# Altium schematic sheet 模拟光伏追踪系统原理图.SchDoc
size 444 x 294 mm; PageSetup: Record=PageOptions嶤enterHorizontal=True嶤enterVertical=True嶱rintScale=0.64嶺Correction=1.00嶻Correction=1.00嶱rintKind=0嶣orderSize=5000000嶭eftOffset=0嶣ottomOffset=0嶰rientation=2嶱aperLength=1000嶱aperWidth=1000嶴cale=100嶱aperSource=7嶱rintQuality=-4嶮ediaType=1嶥itherType=10嶱aperKind=A4 210 x 297 毫米嶱rintScaleMode=1
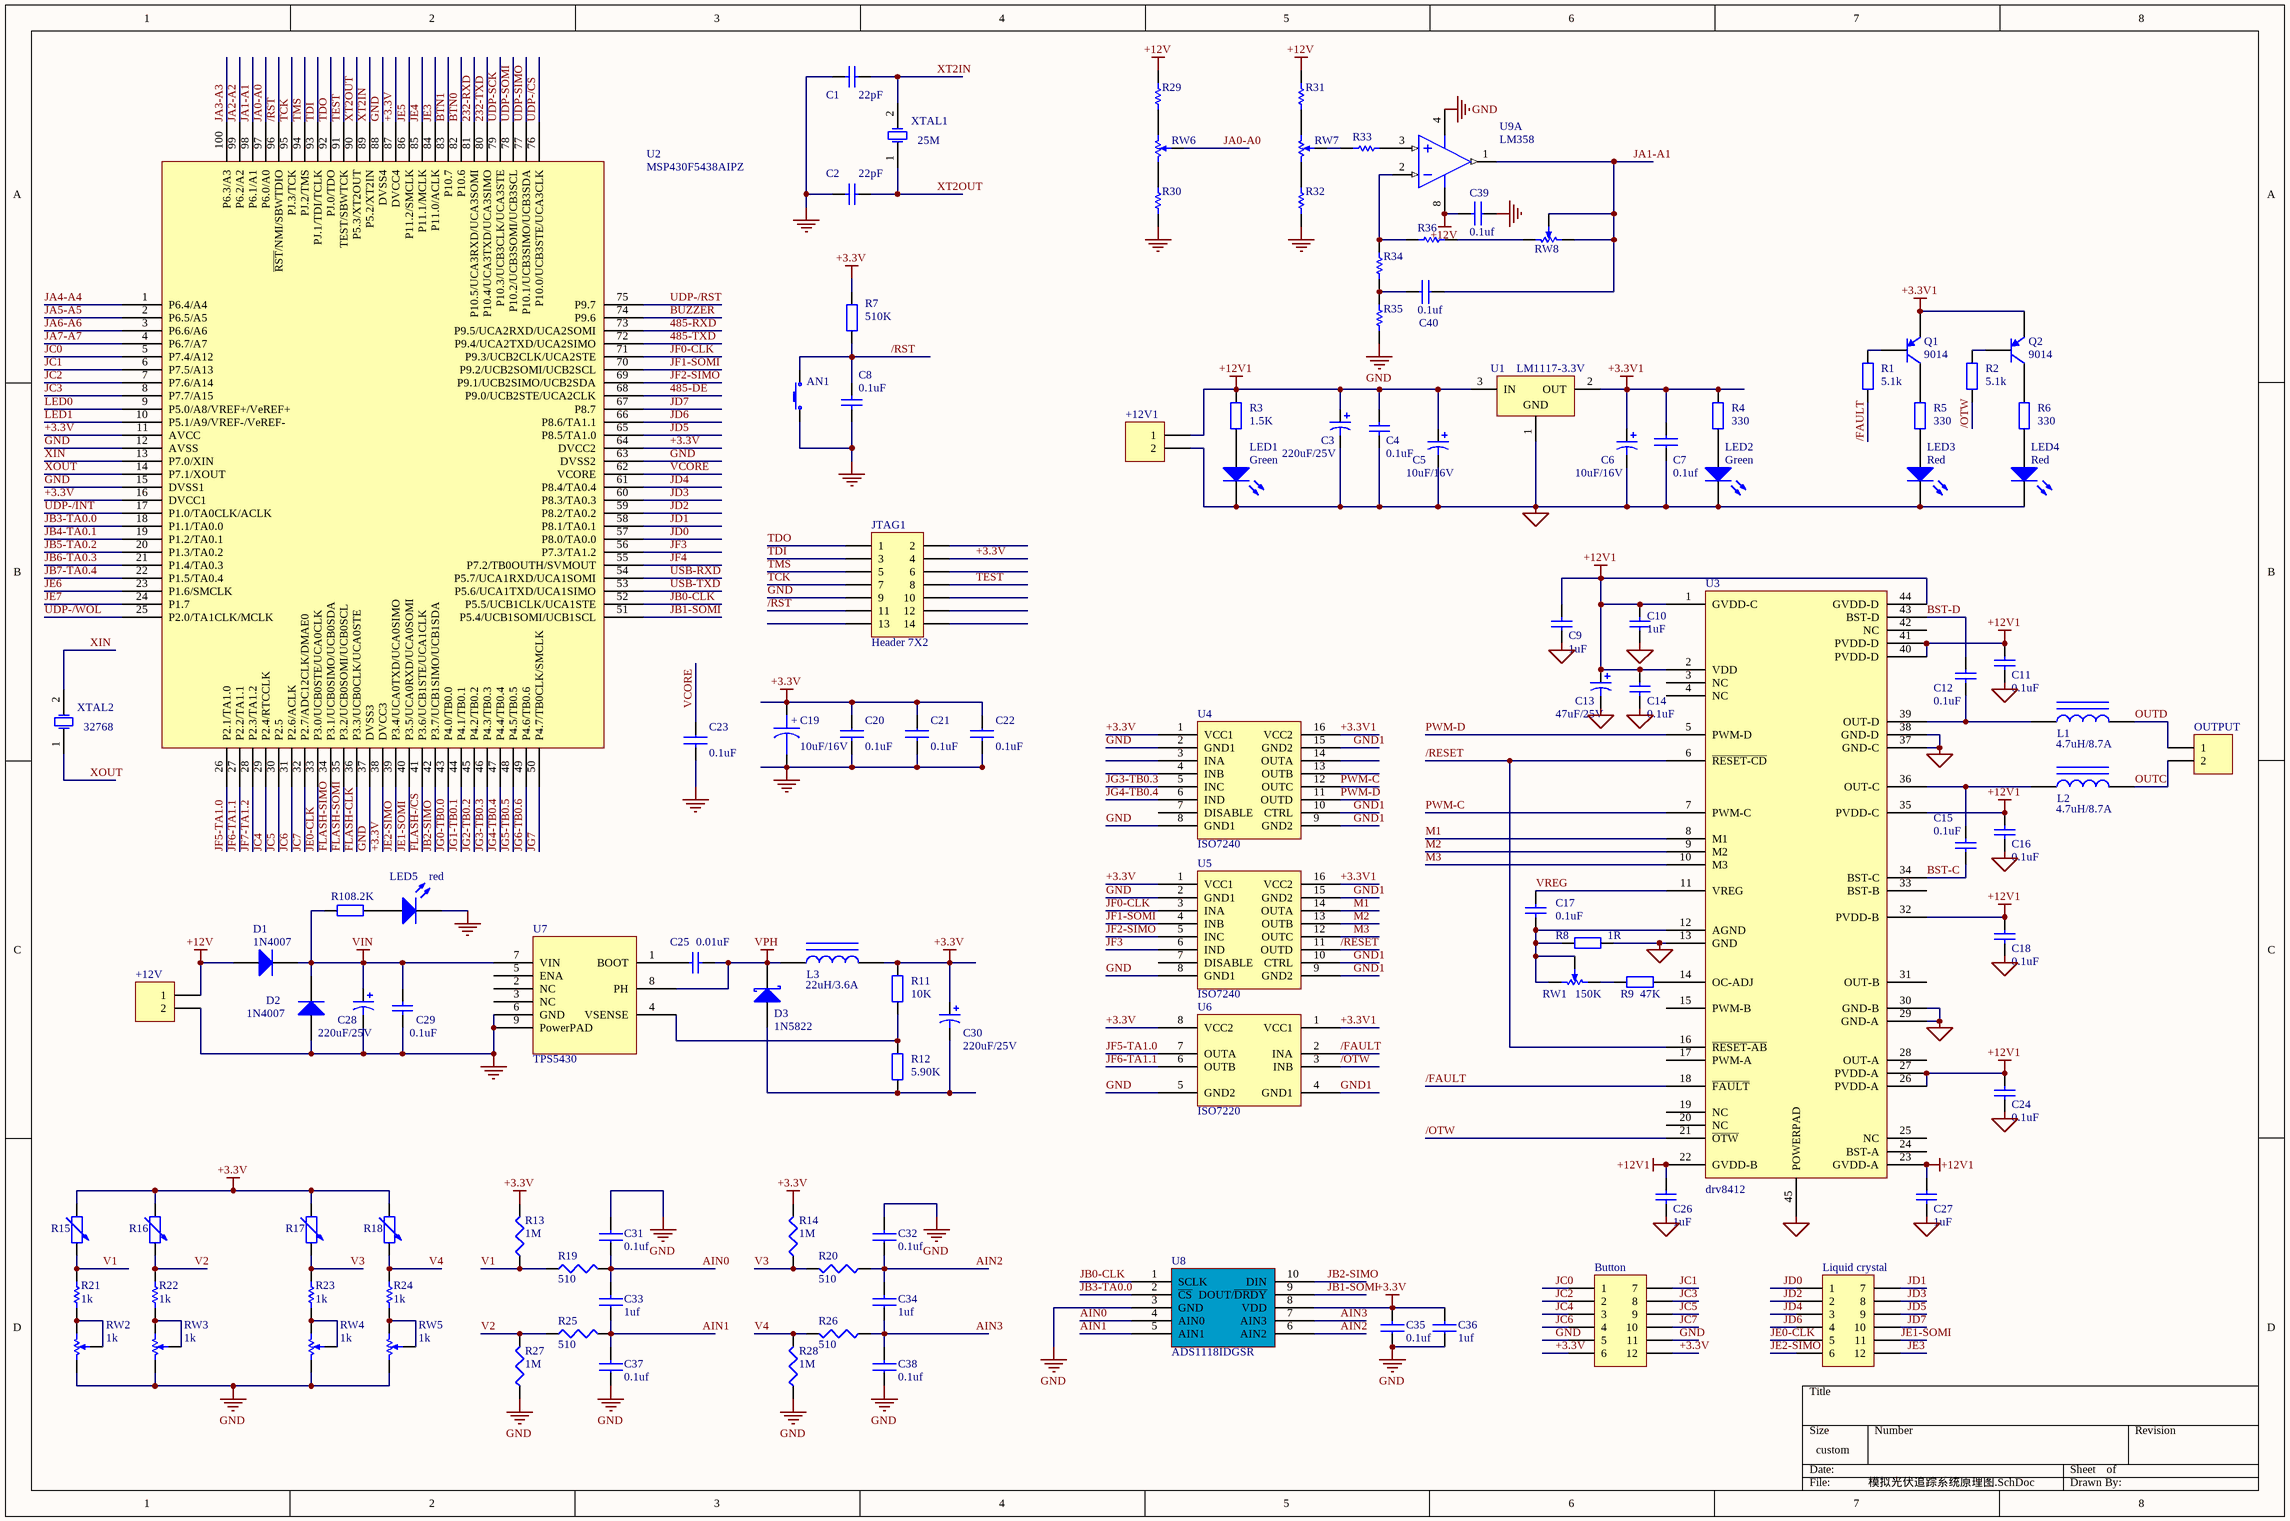
[diagram p0: 模拟光伏追踪系统原理图.SchDoc]

## Parts
+12V  Comment  [接线端子]  (value not drawn)
+12V1  Comment  [接线端子]  (value not drawn)
AN1  key  [AN6X6]  (value not drawn)
Button  Header 6X2A  [PMOD]  (value not drawn)
C1  value 22pF  [0805C]  (hidden comment: Cap)
C2  value 22pF  [0805C]  (hidden comment: Cap)
C3  value 220uF/25V  [CD-220uF-25V]  (hidden comment: Cap Pol1)
C4  value 0.1uF  [0805C]  (hidden comment: Cap)
C5  10uF/16V  [A3216]
C6  10uF/16V  [A3216]
C7  0.1uf  [0805C]
C8  value 0.1uF  [0805C]  (hidden comment: Cap)
C9  value 1uF  [0805C]  (hidden comment: Cap)
C10  value 1uF  [0805C]  (hidden comment: Cap)
C11  value 0.1uF  [0805C]  (hidden comment: Cap)
C12  value 0.1uF  [0805C]  (hidden comment: Cap)
C13  value 47uF/25V  [CD-220uF-25V]  (hidden comment: Cap Pol1)
C14  value 0.1uF  [0805C]  (hidden comment: Cap)
C15  value 0.1uF  [0805C]  (hidden comment: Cap)
C16  value 0.1uF  [0805C]  (hidden comment: Cap)
C17  value 0.1uF  [0805C]  (hidden comment: Cap)
C18  value 0.1uF  [0805C]  (hidden comment: Cap)
C19  10uF/16V  [A3216]
C20  0.1uF  [0805C]
C21  0.1uF  [0805C]
C22  0.1uF  [0805C]
C23  0.1uF  [0805C]
C24  value 0.1uF  [0805C]  (hidden comment: Cap)
C25  value 0.01uF  [0805C]  (hidden comment: Cap)
C26  value 1uF  [0805C]  (hidden comment: Cap)
C27  value 1uF  [0805C]  (hidden comment: Cap)
C28  value 220uF/25V  [CD-220uF-25V]  (hidden comment: Cap Pol1)
C29  value 0.1uF  [0805C]  (hidden comment: Cap)
C30  value 220uF/25V  [CD-220uF-25V]  (hidden comment: Cap Pol1)
C31  0.1uf  [0805C]
C32  0.1uf  [0805C]
C33  1uf  [0805C]
C34  1uf  [0805C]
C35  0.1uf  [0805C]
C36  1uf  [0805C]
C37  0.1uf  [0805C]
C38  0.1uf  [0805C]
C39  0.1uf  [0805C]
C40  0.1uf  [0805C]
D1  1N4007  [D1206]
D2  1N4007  [D1206]
D3  D Schottky  [D1206]  (value not drawn)
JTAG1  Header 7X2  [HDR2X7]
L1  value 4.7uH/8.7A  [CDRH127]  (hidden comment: Inductor Iron)
L2  value 4.7uH/8.7A  [CDRH127]  (hidden comment: Inductor Iron)
L3  value 22uH/3.6A  [CDRH127]  (hidden comment: Inductor Iron)
LED1  (no value)  [0805LED]
LED2  (no value)  [0805LED]
LED3  (no value)  [0805LED]
LED4  (no value)  [0805LED]
LED5  (no value)  [0805LED]
Liquid_crystal  Header 6X2A  [PMOD]  (value not drawn)
OUTPUT  Comment  [接线端子]  (value not drawn)
Q1  9014  [SOT-23B]
Q2  9014  [SOT-23B]
R1  value 5.1k  [0805R]  (hidden comment: Res2)
R2  value 5.1k  [0805R]  (hidden comment: Res2)
R3  value 1.5K  [0805R]  (hidden comment: Res2)
R4  value 330  [0805R]  (hidden comment: Res2)
R5  value 330  [0805R]  (hidden comment: Res2)
R6  value 330  [0805R]  (hidden comment: Res2)
R7  value 510K  [0805R]  (hidden comment: Res2)
R8  value 1R  [0805R]  (hidden comment: Res2)
R9  value 47K  [0805R]  (hidden comment: Res2)
R10  value 8.2K  [0805R]  (hidden comment: Res2)
R11  value 10K  [0805R]  (hidden comment: Res2)
R12  value 5.90K  [0805R]  (hidden comment: Res2)
R13  1M  [0805R]
R14  1M  [0805R]
R15  (no value)  [RL]
R16  (no value)  [RL]
R17  (no value)  [RL]
R18  (no value)  [RL]
R19  510  [0805R]
R20  510  [0805R]
R21  1k  [0805R]
R22  1k  [0805R]
R23  1k  [0805R]
R24  1k  [0805R]
R25  510  [0805R]
R26  510  [0805R]
R27  1M  [0805R]
R28  1M  [0805R]
R29  (no value)  [0805R]
R30  (no value)  [0805R]
R31  (no value)  [0805R]
R32  (no value)  [0805R]
R33  (no value)  [0805R]
R34  (no value)  [0805R]
R35  (no value)  [0805R]
R36  (no value)  [0805R]
RW1  150K  [3362RW]
RW2  1k  [3296W]
RW3  1k  [3296W]
RW4  1k  [3296W]
RW5  1k  [3296W]
RW6  (no value)  [3296W]
RW7  (no value)  [3296W]
RW8  (no value)  [3296W]
U1  LM1117-3.3V  [SOT-223]
U2  MSP430F5438AIPZ  [TSQFP50P1600X1600X160-100N]
U3  drv8412  [SOP127P600-8N]
U4  ISO7240  [SOIC-16]
U5  ISO7240  [SOIC-16]
U6  ISO7220  [SOIC-8]
U7  TPS5430  [SOIC127P600X170_HS-8N]
U8  ADS1118IDGSR  [VSSOP-10]
U9  LM358  [SOIC-8]  (part A of 2)
XTAL1  XTAL  [XTAL-A]  (value not drawn)
XTAL2  XTAL  [XTAL-B]  (value not drawn)

## Nets
+3.3V: Button.6 Button.12 C19.1 C20.1 C21.1 C22.1 C30.1 C35.2 C36.2 JTAG1.4 L3.2 R7.2 R11.2 R13.2 R14.2 R15.1 R16.1 R17.1 R18.1 U2.11(AVCC) U2.16(DVCC1) U2.38(DVCC3) U2.64(DVCC2) U2.87(DVCC4) U4.1(VCC1) U5.1(VCC1) U6.8(VCC2) U8.8(VDD)
+3.3V1: C6.1 C7.2 Q1.3(E) Q2.3(E) R4.1 U1.2(OUT) U4.16(VCC2) U5.16(VCC2) U6.1(VCC1)
+12V: +12V.1 C39.2 D1.1(A) R29.2 R31.2 U9.8(V+)
+12V1: +12V1.1 C3.1 C4.2 C5.1 C9.2 C10.2 C11.2 C13.1 C14.2 C16.2 C18.2 C24.2 C26.2 C27.2 R3.2 U1.3(IN) U3.1(GVDD-C) U3.2(VDD) U3.22(GVDD-B) U3.23(GVDD-A) U3.26(PVDD-A) U3.27(PVDD-A) U3.32(PVDD-B) U3.35(PVDD-C) U3.40(PVDD-D) U3.41(PVDD-D) U3.44(GVDD-D)
GND: +12V.2 AN1.1 Button.5 Button.11 C1.1 C2.1 C8.1 C19.2 C20.2 C21.2 C22.2 C23.2 C28.2 C29.1 C31.2 C32.2 C35.1 C36.1 C37.1 C38.1 C39.1 D2.1(A) JTAG1.9 LED5.2(K) R27.1 R28.1 R30.1 R32.1 R35.1 RW2.1 RW3.1 RW4.1 RW5.1 U2.12(AVSS) U2.15(DVSS1) U2.37(DVSS3) U2.63(DVSS2) U2.88(DVSS4) U4.2(GND1) U4.8(GND1) U5.2(GND1) U5.8(GND1) U6.5(GND2) U7.6(GND) U7.9(PowerPAD) U8.3(GND) U9.4(V-)
GND1: +12V1.2 C3.2 C4.1 C5.2 C6.2 C7.1 C9.1 C10.1 C11.1 C13.2 C14.1 C16.1 C18.1 C24.1 C26.1 C27.1 LED1.2(K) LED2.2(K) LED3.2(K) LED4.2(K) R8.2 U1.1(GND) U3.13(GND) U3.29(GND-A) U3.30(GND-B) U3.37(GND-C) U3.38(GND-D) U3.45(POWERPAD) U4.9(GND2) U4.10(CTRL) U4.15(GND2) U5.9(GND2) U5.10(CTRL) U5.15(GND2) U6.4(GND1)
VIN: C28.1 C29.2 D1.2(K) D2.2(K) R10.1 U7.7(VIN)
VPH: C25.2 D3.2(K) L3.1 U7.8(PH)
232-RXD: U2.81(P10.5/UCA3RXD/UCA3SOMI)
232-TXD: U2.80(P10.4/UCA3TXD/UCA3SIMO)
485-DE: U2.68(P9.0/UCB2STE/UCA2CLK)
485-RXD: U2.73(P9.5/UCA2RXD/UCA2SOMI)
485-TXD: U2.72(P9.4/UCA2TXD/UCA2SIMO)
/FAULT: R1.2 U3.18(~{FAULT}) U6.2(INA)
/OTW: R2.2 U3.21(~{OTW}) U6.3(INB)
/RESET: U3.6(~{RESET-CD}) U3.16(~{RESET-AB}) U5.11(OUTD)
/RST: AN1.2 C8.2 JTAG1.11 R7.1 U2.96(~{RST}/NMI/SBWTDIO)
AIN0: C31.1 C33.2 R19.2 U8.4(AIN0)
AIN1: C33.1 C37.2 R25.2 U8.5(AIN1)
AIN2: C32.1 C34.2 R20.1 U8.6(AIN2)
AIN3: C34.1 C38.2 R26.1 U8.7(AIN3)
BST-C: C15.1 U3.34(BST-C)
BST-D: C12.2 U3.43(BST-D)
BTN0: U2.82(P10.6)
BTN1: U2.83(P10.7)
BUZZER: U2.74(P9.6)
FLASH-/CS: U2.41(P3.6/UCB1STE/UCA1CLK)
FLASH-CLK: U2.36(P3.3/UCB0CLK/UCA0STE)
FLASH-SIMO: U2.34(P3.1/UCB0SIMO/UCB0SDA)
FLASH-SOMI: U2.35(P3.2/UCB0SOMI/UCB0SCL)
JA0-A0: RW6.2 U2.97(P6.0/A0)
JA1-A1: C40.1 RW8.1 RW8.2 U2.98(P6.1/A1) U9.1(OUTA)
JA2-A2: U2.99(P6.2/A2)
JA3-A3: U2.100(P6.3/A3)
JA4-A4: U2.1(P6.4/A4)
JA5-A5: U2.2(P6.5/A5)
JA6-A6: U2.3(P6.6/A6)
JA7-A7: U2.4(P6.7/A7)
JB0-CLK: U2.52(P5.5/UCB1CLK/UCA1STE) U8.1(SCLK)
JB1-SOMI: U2.51(P5.4/UCB1SOMI/UCB1SCL) U8.9(DOUT/~{DRDY})
JB2-SIMO: U2.42(P3.7/UCB1SIMO/UCB1SDA) U8.10(DIN)
JB3-TA0.0: U2.18(P1.1/TA0.0) U8.2(~{CS})
JB4-TA0.1: U2.19(P1.2/TA0.1)
JB5-TA0.2: U2.20(P1.3/TA0.2)
JB6-TA0.3: U2.21(P1.4/TA0.3)
JB7-TA0.4: U2.22(P1.5/TA0.4)
JC0: Button.1 U2.5(P7.4/A12)
JC1: Button.7 U2.6(P7.5/A13)
JC2: Button.2 U2.7(P7.6/A14)
JC3: Button.8 U2.8(P7.7/A15)
JC4: Button.3 U2.29(P2.4/RTCCLK)
JC5: Button.9 U2.30(P2.5)
JC6: Button.4 U2.31(P2.6/ACLK)
JC7: Button.10 U2.32(P2.7/ADC12CLK/DMAE0)
JD0: Liquid_crystal.1 U2.57(P8.0/TA0.0)
JD1: Liquid_crystal.7 U2.58(P8.1/TA0.1)
JD2: Liquid_crystal.2 U2.59(P8.2/TA0.2)
JD3: Liquid_crystal.8 U2.60(P8.3/TA0.3)
JD4: Liquid_crystal.3 U2.61(P8.4/TA0.4)
JD5: Liquid_crystal.9 U2.65(P8.5/TA1.0)
JD6: Liquid_crystal.4 U2.66(P8.6/TA1.1)
JD7: Liquid_crystal.10 U2.67(P8.7)
JE0-CLK: Liquid_crystal.5 U2.33(P3.0/UCB0STE/UCA0CLK)
JE1-SOMI: Liquid_crystal.11 U2.40(P3.5/UCA0RXD/UCA0SOMI)
JE2-SIMO: Liquid_crystal.6 U2.39(P3.4/UCA0TXD/UCA0SIMO)
JE3: Liquid_crystal.12 U2.84(P11.0/ACLK)
JE4: U2.85(P11.1/MCLK)
JE5: U2.86(P11.2/SMCLK)
JE6: U2.23(P1.6/SMCLK)
JE7: U2.24(P1.7)
JF0-CLK: U2.71(P9.3/UCB2CLK/UCA2STE) U5.3(INA)
JF1-SOMI: U2.70(P9.2/UCB2SOMI/UCB2SCL) U5.4(INB)
JF2-SIMO: U2.69(P9.1/UCB2SIMO/UCB2SDA) U5.5(INC)
JF3: U2.56(P7.3/TA1.2) U5.6(IND)
JF4: U2.55(P7.2/TB0OUTH/SVMOUT)
JF5-TA1.0: U2.26(P2.1/TA1.0) U6.7(OUTA)
JF6-TA1.1: U2.27(P2.2/TA1.1) U6.6(OUTB)
JF7-TA1.2: U2.28(P2.3/TA1.2)
JG0-TB0.0: U2.43(P4.0/TB0.0)
JG1-TB0.1: U2.44(P4.1/TB0.1)
JG2-TB0.2: U2.45(P4.2/TB0.2)
JG3-TB0.3: U2.46(P4.3/TB0.3) U4.5(INC)
JG4-TB0.4: U2.47(P4.4/TB0.4) U4.6(IND)
JG5-TB0.5: U2.48(P4.5/TB0.5)
JG6-TB0.6: U2.49(P4.6/TB0.6)
JG7: U2.50(P4.7/TB0CLK/SMCLK)
LED0: U2.9(P5.0/A8/VREF+/VeREF+)
LED1: U2.10(P5.1/A9/VREF-/VeREF-)
M1: U3.8(M1) U5.14(OUTA)
M2: U3.9(M2) U5.13(OUTB)
M3: U3.10(M3) U5.12(OUTC)
OUTC: L2.2 OUTPUT.2
OUTD: L1.2 OUTPUT.1
PWM-C: U3.7(PWM-C) U4.12(OUTC)
PWM-D: U3.5(PWM-D) U4.11(OUTD)
TCK: JTAG1.7 U2.95(PJ.3/TCK)
TDI: JTAG1.3 U2.93(PJ.1/TDI/TCLK)
TDO: JTAG1.1 U2.92(PJ.0/TDO)
TEST: JTAG1.8 U2.91(TEST/SBWTCK)
TMS: JTAG1.5 U2.94(PJ.2/TMS)
UDP-/CS: U2.76(P10.0/UCB3STE/UCA3CLK)
UDP-/INT: U2.17(P1.0/TA0CLK/ACLK)
UDP-/RST: U2.75(P9.7)
UDP-/WOL: U2.25(P2.0/TA1CLK/MCLK)
UDP-SCK: U2.79(P10.3/UCB3CLK/UCA3STE)
UDP-SIMO: U2.77(P10.1/UCB3SIMO/UCB3SDA)
UDP-SOMI: U2.78(P10.2/UCB3SOMI/UCB3SCL)
USB-RXD: U2.54(P5.7/UCA1RXD/UCA1SOMI)
USB-TXD: U2.53(P5.6/UCA1TXD/UCA1SIMO)
V1: R13.1 R15.2 R19.1 R21.2
V2: R16.2 R22.2 R25.1 R27.2
V3: R14.1 R17.2 R20.2 R23.2
V4: R18.2 R24.2 R26.2 R28.2
VCORE: C23.1 U2.62(VCORE)
VREG: C17.2 U3.11(VREG)
XIN: U2.13(P7.0/XIN) XTAL2.2(OSC2)
XOUT: U2.14(P7.1/XOUT) XTAL2.1(OSC1)
XT2IN: C1.2 U2.89(P5.2/XT2IN) XTAL1.2(OSC2)
XT2OUT: C2.2 U2.90(P5.3/XT2OUT) XTAL1.1(OSC1)
NetC12_1: C12.1 L1.1 U3.39(OUT-D)
NetC15_2: C15.2 L2.1 U3.36(OUT-C)
NetC17_1: C17.1 R8.1 RW1.2 RW1.3 U3.12(AGND)
NetC25_1: C25.1 U7.1(BOOT)
NetC30_2: C30.2 D3.1(A) R12.1
NetC40_2: C40.2 R34.1 R35.2
NetLED1_1: LED1.1(A) R3.1
NetLED2_1: LED2.1(A) R4.2
NetLED3_1: LED3.1(A) R5.2
NetLED4_1: LED4.1(A) R6.2
NetLED5_1: LED5.1(A) R10.2
NetQ1_1: Q1.1(C) R5.1
NetQ1_2: Q1.2(B) R1.1
NetQ2_1: Q2.1(C) R6.1
NetQ2_2: Q2.2(B) R2.1
NetR9_1: R9.1 RW1.1
NetR9_2: R9.2 U3.14(OC-ADJ)
NetR11_1: R11.1 R12.2 U7.4(VSENSE)
NetR21_1: R21.1 RW2.2 RW2.3
NetR22_1: R22.1 RW3.2 RW3.3
NetR23_1: R23.1 RW4.2 RW4.3
NetR24_1: R24.1 RW5.2 RW5.3
NetR29_1: R29.1 RW6.3
NetR30_2: R30.2 RW6.1
NetR31_1: R31.1 RW7.3
NetR32_2: R32.2 RW7.1
NetR33_1: R33.1 U9.3(INA+)
NetR33_2: R33.2 RW7.2
NetR34_2: R34.2 R36.2 U9.2(INA-)
NetR36_1: R36.1 RW8.3

Not connected (* = marked no-connect by the designer): JTAG1 2 6 10 12 13 14; U3 3(NC) 4(NC) 15(PWM-B) 17(PWM-A) 19(NC) 20(NC) 24(BST-A) 25(NC) 28(OUT-A) 31(OUT-B) 33(BST-B) 42(NC); U4 3(INA) 4(INB) 7(DISABLE) 13(OUTB) 14(OUTA); U5 7(DISABLE); U7 2(NC) 3(NC) 5(ENA)

## Notes on the sheet
- (in symbol CAPACITOR POL) +
- (in symbol D Schottky) 1N5822
- (in symbol LED2) Green; Red; red
- (in symbol XTAL) 32768; 25M

## Library data of the parts
+12V +12V1 OUTPUT = Header 2: Header, 2-Pin; LatestRevisionDate: 17-Jul-2002; LatestRevisionNote: Re-released for DXP Platform.; Publisher: Altium Limited
AN1 = Key_2
Button Liquid_crystal = Header 6X2A: Header, 6-Pin, Dual row; LatestRevisionDate: 17-Jul-2002; LatestRevisionNote: Re-released for DXP Platform.; Publisher: Altium Limited
C1 C2 C4 C8-C12 C14-C18 C24-C27 C29 = Cap: Capacitor; Published: 8-Jun-2000; LatestRevisionDate: 17-Jul-2002; LatestRevisionNote: Re-released for DXP Platform.; PackageReference: RAD-0.3; Publisher: Altium Limited
C3 C13 C28 C30 = Cap Pol1: Polarized Capacitor (Radial); Published: 8-Jun-2000; LatestRevisionDate: 17-Jul-2002; LatestRevisionNote: Re-released for DXP Platform.; PackageReference: RB7.6-15; Publisher: Altium Limited
C5 C6 = Cap Pol1: Polarized Capacitor (Radial); Value: 100uF; Published: 8-Jun-2000; LatestRevisionDate: 17-Jul-2002; LatestRevisionNote: Re-released for DXP Platform.; Publisher: Altium Limited
C7 C31-C40 = Cap
C19 = CAPACITOR POL: Capacitor
C20-C22 = CC_0.1U_16V_X7R_0603: Text Field1: 20; Text Field2: 10
C23 = CC_0.01U_16V_X7R_0603: Text Field1: 20; Text Field2: 10
D1 D2 = DIODE
D3 = D Schottky: Schottky Diode; Published: 8-Jun-2000; LatestRevisionDate: 17-Jul-2002; LatestRevisionNote: Re-released for DXP Platform.; PackageReference: SMB; Publisher: Altium Limited; Code_JEDEC: DO-214-AA
JTAG1 = Header 7X2: Header, 7-Pin, Dual row; LatestRevisionDate: 17-Jul-2002; LatestRevisionNote: Re-released for DXP Platform.; Publisher: Altium Limited
L1-L3 = Inductor Iron: Magnetic-Core Inductor; Published: 24-Mar-1999; LatestRevisionDate: 17-Jul-2002; LatestRevisionNote: Re-released for DXP Platform.; PackageReference: AXIAL-0.9; Publisher: Altium Limited
LED1-LED5 = LED2: Typical RED, GREEN, YELLOW, AMBER GaAs LED; Published: 8-Jun-2000; LatestRevisionDate: 17-Jul-2002; LatestRevisionNote: Re-released for DXP Platform.; PackageDocument: Feb-2002; PackageReference: 3.2X1.6X1.1; Publisher: Altium Limited
Q1 Q2 = PNP: PNP Bipolar Transistor; Published: 8-Jun-2000; LatestRevisionDate: 17-Jul-2002; LatestRevisionNote: Re-released for DXP Platform.; PackageReference: SOT-23B; Publisher: Altium Limited; Code_JEDEC: SOT-23
R1-R12 = Res2: Resistor; Published: 8-Jun-2000; LatestRevisionDate: 17-Jul-2002; LatestRevisionNote: Re-released for DXP Platform.; PackageReference: AXIAL-0.4; Publisher: Altium Limited
R13 R14 R19 R20 R25-R28 = Res1
R15-R18 = Res Adj2: Variable Resistor; Value: 1K; Set Position: 0.5; Published: 8-Jun-2000; LatestRevisionDate: 17-Jul-2002; LatestRevisionNote: Re-released for DXP Platform.; PackageReference: AXIAL-0.6; Publisher: Altium Limited
R21-R24 R29-R36 = Res2
RW1-RW8 = Res adj1
U1 = LM1117T-3.3: 800mA Low-Dropout Linear Regulator; Manufacturer: National Semiconductor; CompType: LDO IC; PackageTopMarking: NSUZXYTTE#*LM1117T*3.3; Published: 4-Dec-2008; DatasheetVersion: Apr-2006; PackageVersion: revL, Jan-1992; PackageReference: T03B; Publisher: Altium Limited; PackageDescription: TO-220, Molded, 3 Lead, Straight; PartNumber: LM1117T-3.3; RoHS: O; PinCount: 3; DigiKeyPartNumber: LM1117T-3.3-ND; ComponentLink1Description: LM1117 Datasheet; ComponentLink1URL: http://www.national.com/ds/LM/LM1117.pdf; ComponentLink2Description: LM1117 Web Page; ComponentLink2URL: http://www.national.com/pf/LM/LM1117.html; ComponentLink3Description: T03B Package Page; ComponentLink3URL: http://www.national.com/packaging/folders/t03b.html
U8 = ADS118
U9 = LF353M
XTAL1 XTAL2 = XTAL: Crystal Oscillator; Published: 8-Jun-2000; LatestRevisionDate: 17-Jul-2002; LatestRevisionNote: Re-released for DXP Platform.; PackageReference: R38; Publisher: Altium Limited